# EasyEDA Pro project ProPrj_DMTBlinky2_2025-11-07.epro

# Board DMTBlinky
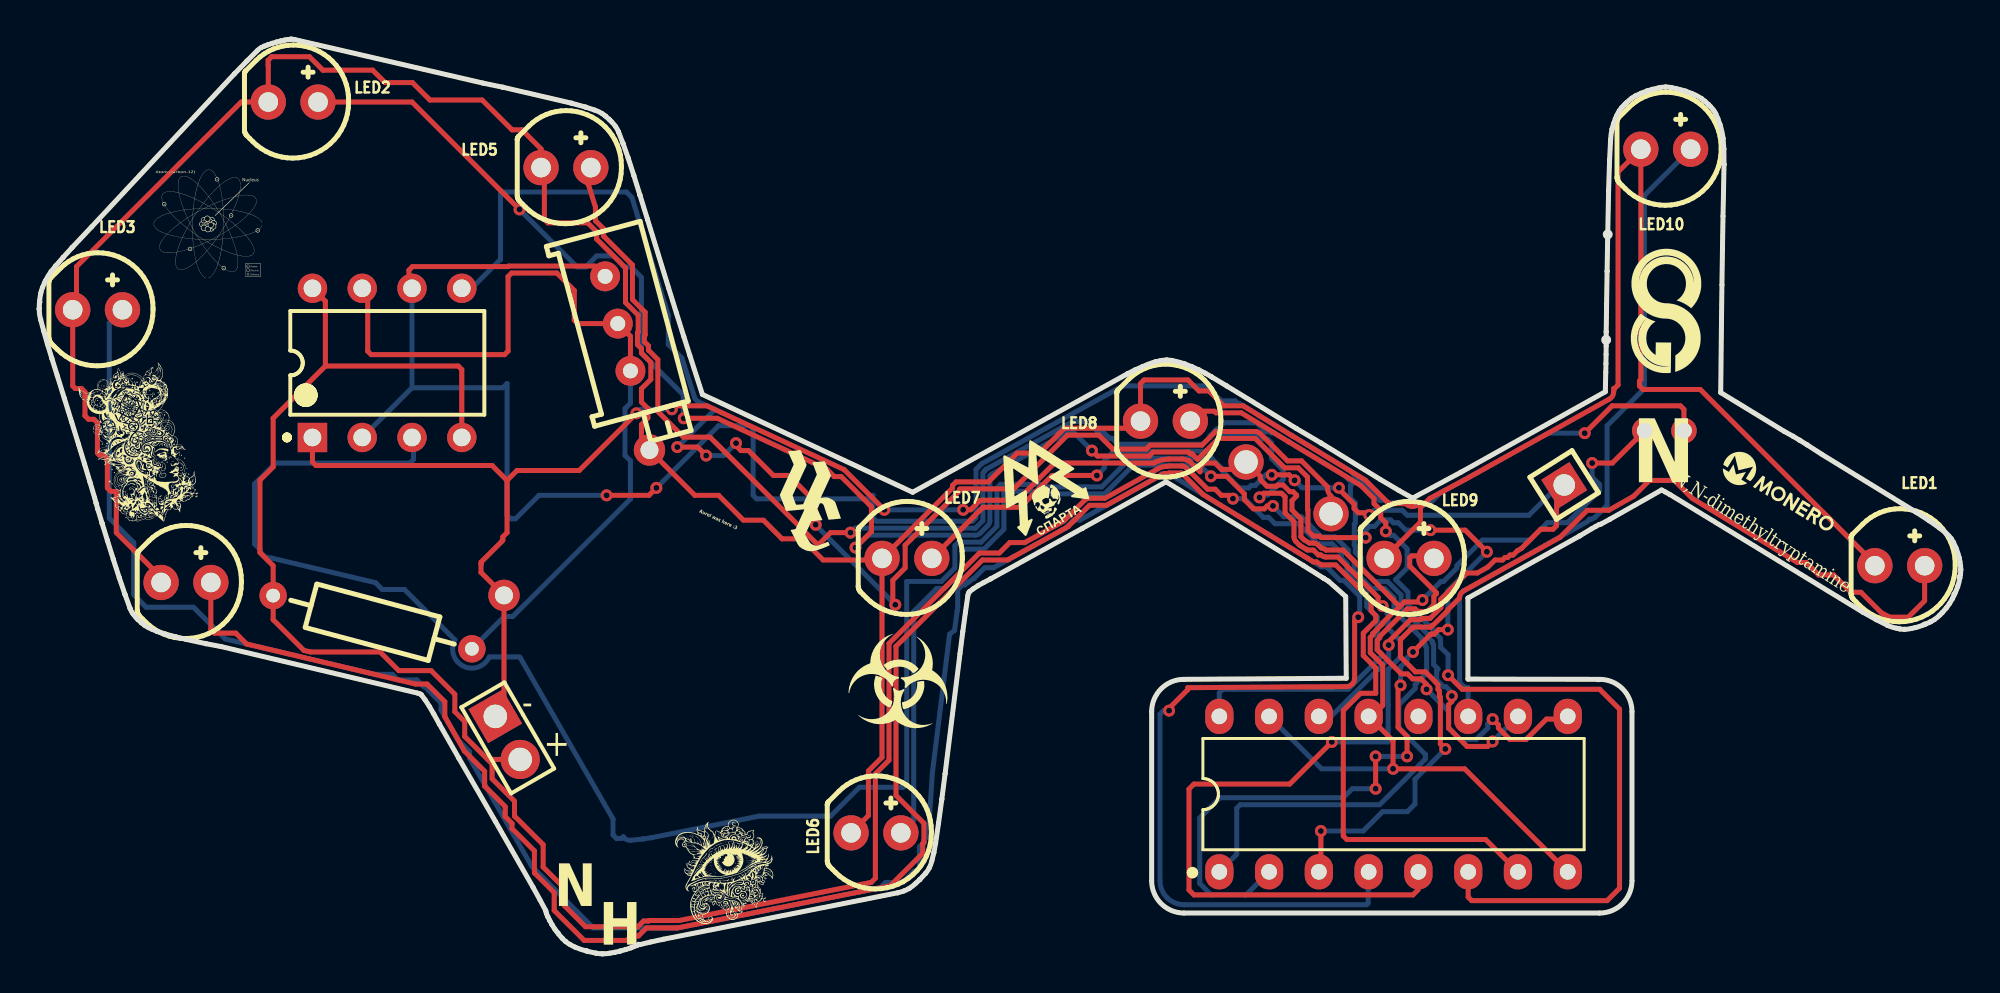
[diagram p0: board, top side]
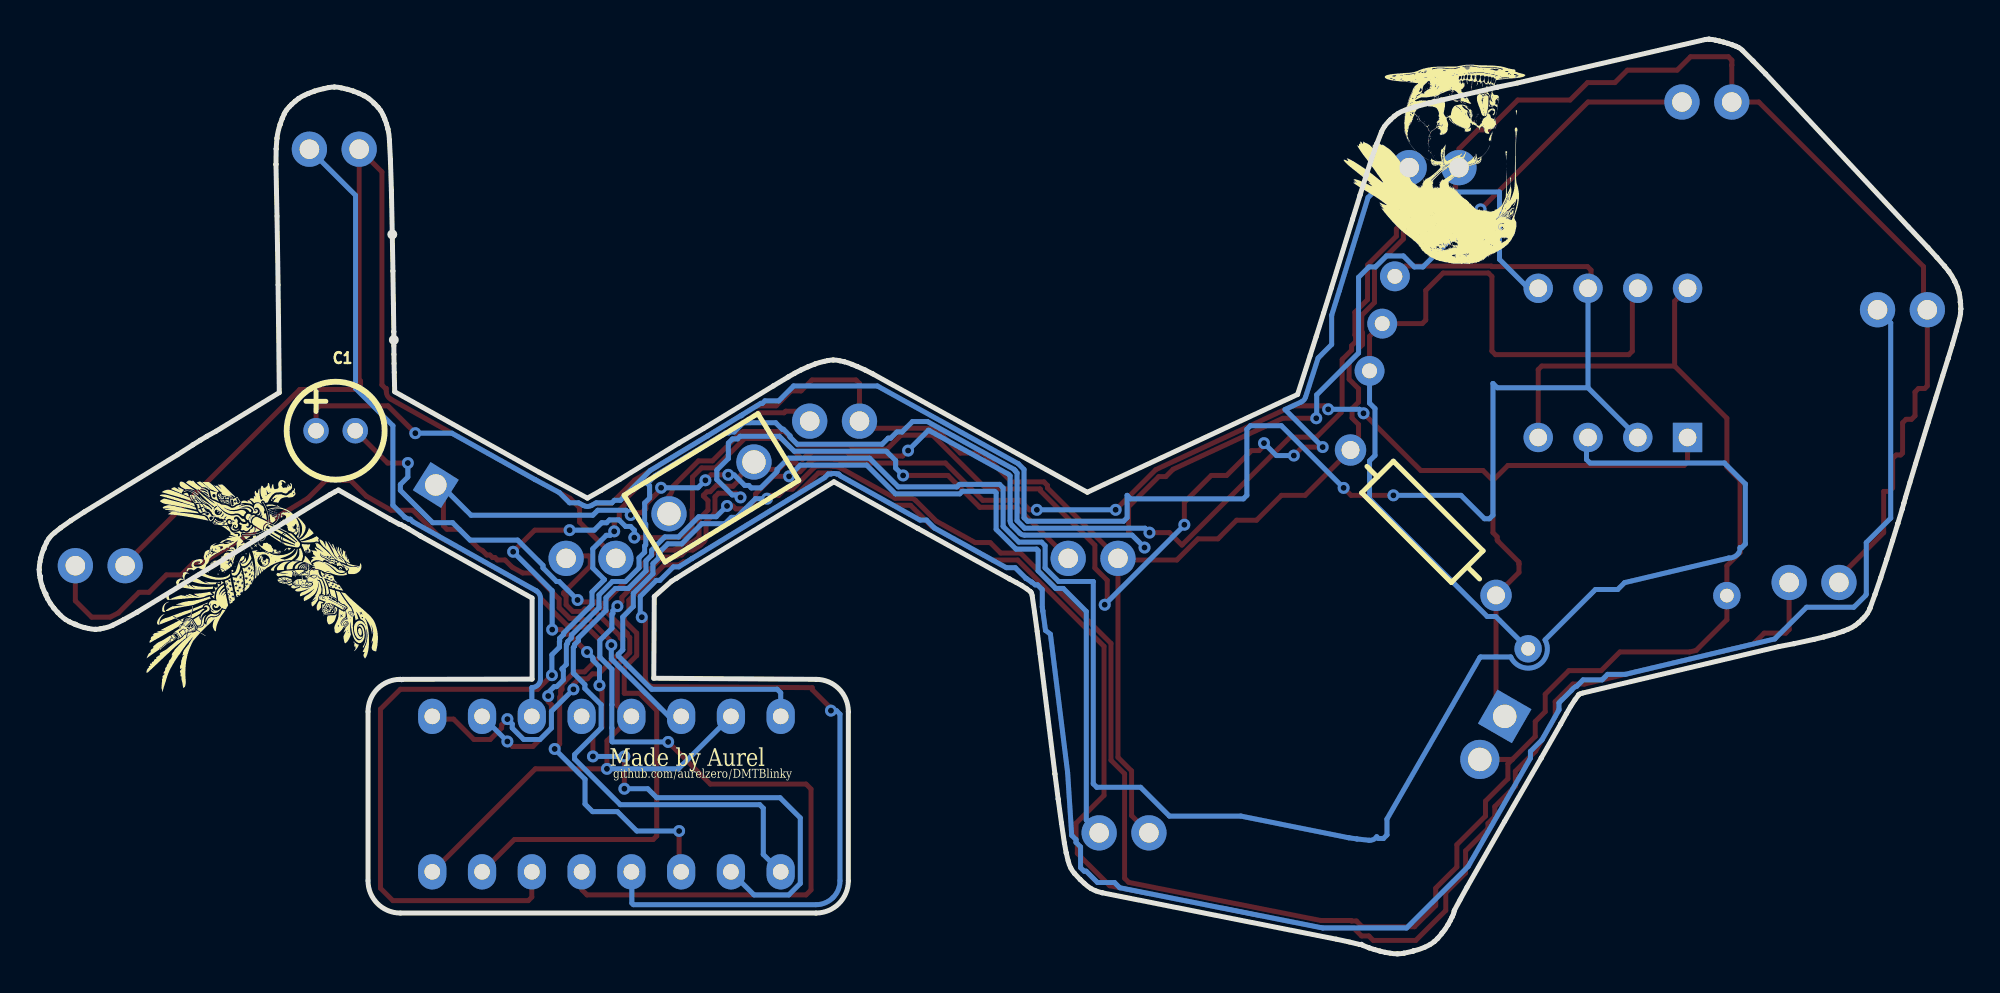
[diagram p1: board, bottom side, seen from below]

Outline 98.06 x 46.72 mm; copper layers: Top Layer, Bottom Layer. Coordinates in mm from the lower left corner of the outline.
Outline path: 0,32.95 arc(0,32.95) 0,32.95 arc(0,32.94) 0,32.94 arc(0,32.83) 0.01,32.72 arc(0.04,32.55) 0.08,32.38 0.22,31.84 arc(0.22,31.84) 0.22,31.83 0.42,31.15 arc(0.42,31.15) 0.42,31.14 0.65,30.42 arc(0.64,30.42) 0.65,30.42 0.92,29.54 1.28,28.38 1.66,27.15 2,26.04 2.31,25.02 2.59,24.09 2.82,23.31 2.9,23.02 arc(2.9,23.02) 2.9,23.02 2.99,22.73 arc(2.99,22.73) 2.99,22.73 3.21,21.99 3.48,21.11 arc(3.48,21.11) 3.48,21.11 3.78,20.15 4.09,19.21 arc(4.09,19.21) 4.09,19.21 4.38,18.36 arc(4.38,18.36) 4.38,18.36 4.63,17.65 arc(4.69,17.52) 4.76,17.4 arc(4.84,17.29) 4.94,17.18 5.03,17.08 arc(5.04,17.08) 5.04,17.08 5.21,16.92 arc(5.21,16.91) 5.21,16.91 arc(5.3,16.84) 5.39,16.78 arc(5.57,16.66) 5.77,16.57 6,16.48 arc(6,16.48) 6.01,16.48 6.45,16.33 arc(6.45,16.33) 6.45,16.33 6.99,16.18 arc(7,16.18) 7,16.18 7.5,16.06 arc(7.5,16.06) 7.5,16.06 8.5,15.84 arc(8.51,15.84) 8.51,15.84 9.28,15.7 19.29,13.32 arc(19.37,13.3) 19.44,13.27 arc(19.48,13.25) 19.51,13.22 arc(19.51,13.22) 19.51,13.22 19.69,12.98 19.9,12.65 20.13,12.26 20.42,11.74 arc(20.42,11.73) 20.42,11.73 21.41,10 23.28,6.77 25.2,3.4 25.55,2.76 25.85,2.21 arc(25.85,2.2) 25.86,2.18 arc(25.86,2.11) 25.89,2.05 25.95,1.9 arc(25.96,1.89) 25.96,1.89 26.05,1.7 arc(26.05,1.7) 26.06,1.69 26.17,1.49 arc(26.17,1.49) 26.17,1.48 arc(26.24,1.37) 26.32,1.25 arc(26.37,1.18) 26.43,1.1 arc(26.45,1.08) 26.47,1.07 arc(26.48,1.04) 26.5,1.01 26.69,0.8 arc(26.69,0.8) 26.69,0.79 arc(26.78,0.71) 26.87,0.63 arc(26.97,0.55) 27.09,0.48 arc(27.22,0.4) 27.35,0.34 arc(27.62,0.23) 27.91,0.15 arc(27.92,0.15) 27.94,0.15 arc(27.94,0.15) 27.95,0.15 arc(27.97,0.13) 28,0.12 28.41,0.04 arc(28.41,0.04) 28.41,0.04 arc(28.56,0.01) 28.71,0 arc(28.74,0) 28.78,0 arc(28.95,0.01) 29.12,0.04 29.36,0.08 arc(29.37,0.08) 29.37,0.08 29.63,0.14 arc(29.63,0.14) 29.64,0.14 29.92,0.22 arc(29.92,0.22) 29.93,0.22 30.19,0.31 arc(30.2,0.31) 30.2,0.31 30.52,0.44 arc(30.56,0.46) 30.58,0.49 arc(30.61,0.48) 30.64,0.47 arc(30.65,0.47) 30.67,0.48 31.2,0.6 31.87,0.75 43.81,3.12 arc(43.81,3.12) 43.82,3.12 arc(43.97,3.16) 44.13,3.21 arc(44.26,3.27) 44.39,3.34 arc(44.57,3.46) 44.74,3.61 44.93,3.79 arc(44.93,3.79) 44.94,3.8 45.23,4.12 arc(45.24,4.12) 45.24,4.12 arc(45.33,4.24) 45.42,4.38 arc(45.5,4.57) 45.55,4.76 45.65,5.16 arc(45.65,5.16) 45.65,5.17 45.74,5.65 arc(45.74,5.66) 45.74,5.66 45.89,6.68 46.06,7.9 arc(46.06,7.9) 46.06,7.9 46.23,9.19 46.99,15.34 47.13,16.47 47.27,17.46 47.39,18.3 arc(47.4,18.37) 47.42,18.43 arc(47.44,18.47) 47.47,18.5 arc(47.48,18.5) 47.48,18.5 47.66,18.64 47.91,18.8 48.19,18.96 48.55,19.15 arc(48.55,19.15) 48.55,19.15 53.23,21.74 arc(53.23,21.74) 53.23,21.74 57.5,24.11 64.52,19.83 65.55,19.18 65.79,19.03 66.67,18.25 66.7,14.08 58.42,14.02 arc(57.25,13.54) 56.77,12.37 56.77,3.73 arc(57.25,2.57) 58.42,2.08 79.63,2.08 arc(80.79,2.57) 81.28,3.73 81.28,12.37 arc(80.79,13.54) 79.63,14.02 arc(79.59,14.02) 79.56,14 arc(79.53,14.02) 79.5,14.02 72.91,14.03 72.91,18.17 78.6,21.34 arc(78.6,21.34) 78.61,21.34 79.21,21.7 79.42,21.83 79.6,21.93 arc(79.65,21.93) 79.7,21.95 80.15,22.2 82.79,23.69 82.97,23.6 83.22,23.46 93.06,17.45 arc(93.07,17.45) 93.07,17.45 93.74,17.07 arc(93.75,17.07) 93.75,17.07 94.3,16.79 arc(94.3,16.79) 94.3,16.79 arc(94.53,16.69) 94.77,16.63 94.94,16.6 arc(94.94,16.6) 94.94,16.6 arc(95.06,16.58) 95.19,16.58 arc(95.19,16.58) 95.19,16.58 arc(95.37,16.59) 95.54,16.62 95.75,16.67 arc(95.75,16.67) 95.75,16.67 arc(95.96,16.73) 96.16,16.8 arc(96.18,16.82) 96.2,16.84 arc(96.21,16.83) 96.22,16.83 arc(96.24,16.84) 96.27,16.85 96.51,16.96 arc(96.51,16.96) 96.51,16.96 arc(96.61,17.01) 96.71,17.07 arc(96.85,17.18) 96.98,17.3 97.1,17.42 arc(97.11,17.43) 97.11,17.43 97.31,17.66 arc(97.31,17.66) 97.31,17.66 arc(97.4,17.77) 97.48,17.89 arc(97.56,18.02) 97.63,18.15 arc(97.67,18.23) 97.71,18.32 arc(97.72,18.34) 97.72,18.36 arc(97.72,18.38) 97.72,18.39 arc(97.75,18.42) 97.78,18.45 97.9,18.76 arc(97.9,18.76) 97.9,18.76 arc(97.96,18.98) 98.01,19.2 arc(98.01,19.21) 98.01,19.22 arc(98,19.25) 97.99,19.28 arc(98.02,19.31) 98.04,19.36 arc(98.05,19.49) 98.06,19.63 arc(98.05,19.83) 98.01,20.03 97.98,20.22 arc(97.98,20.22) 97.98,20.22 arc(97.92,20.44) 97.84,20.66 arc(97.83,20.68) 97.81,20.7 arc(97.81,20.7) 97.81,20.71 arc(97.81,20.73) 97.8,20.76 97.69,21.01 arc(97.69,21.01) 97.69,21.01 arc(97.63,21.11) 97.57,21.21 arc(97.43,21.37) 97.28,21.51 96.97,21.75 arc(96.97,21.76) 96.96,21.76 96.45,22.12 arc(96.45,22.12) 96.45,22.12 95.76,22.57 arc(95.75,22.57) 95.75,22.57 91,25.49 90.21,26 arc(90.21,26) 90.21,26 89.84,26.23 arc(89.84,26.23) 89.84,26.23 89.51,26.43 arc(89.51,26.43) 89.5,26.43 89.04,26.69 85.81,28.67 85.85,32.49 85.87,34.17 85.89,35.99 85.92,37.68 85.95,38.92 85.97,40.32 arc(85.97,40.32) 85.97,40.32 arc(85.97,40.32) 85.97,40.33 85.97,41.11 arc(85.97,41.11) 85.97,41.12 85.93,41.65 arc(85.92,41.65) 85.92,41.65 arc(85.86,42) 85.77,42.34 arc(85.77,42.35) 85.76,42.36 arc(85.76,42.38) 85.76,42.39 85.66,42.66 arc(85.66,42.67) 85.65,42.67 85.55,42.91 arc(85.55,42.91) 85.55,42.91 arc(85.5,43) 85.45,43.08 arc(85.36,43.19) 85.27,43.29 85.18,43.39 arc(85.17,43.39) 85.17,43.39 85,43.55 arc(85,43.55) 84.99,43.55 84.83,43.68 arc(84.83,43.68) 84.82,43.68 arc(84.67,43.78) 84.51,43.86 84.33,43.95 arc(84.32,43.95) 84.32,43.95 84.01,44.06 arc(84.01,44.07) 84.01,44.07 arc(83.78,44.14) 83.54,44.19 83.28,44.25 arc(83.28,44.25) 83.28,44.25 arc(83.14,44.27) 83,44.28 arc(82.99,44.28) 82.99,44.28 arc(82.82,44.27) 82.64,44.23 82.32,44.16 arc(82.32,44.16) 82.31,44.16 82.04,44.07 arc(82.04,44.07) 82.03,44.07 81.74,43.96 arc(81.74,43.96) 81.74,43.95 81.47,43.83 arc(81.47,43.83) 81.47,43.83 arc(81.37,43.77) 81.27,43.71 arc(81.13,43.6) 81,43.48 arc(80.98,43.46) 80.97,43.44 arc(80.94,43.42) 80.92,43.41 80.77,43.24 arc(80.76,43.24) 80.76,43.24 arc(80.7,43.16) 80.64,43.08 arc(80.56,42.95) 80.5,42.82 80.43,42.66 arc(80.43,42.65) 80.43,42.65 80.33,42.39 arc(80.33,42.39) 80.33,42.38 80.26,42.14 arc(80.26,42.13) 80.26,42.13 arc(80.21,41.86) 80.19,41.59 80.13,40.55 arc(80.13,40.55) 80.13,40.55 80.09,39.01 arc(80.09,39.01) 80.09,39.01 80.04,36.75 80.01,34.87 79.98,33.19 79.96,31.78 arc(79.96,31.78) 79.96,31.78 79.96,31.36 79.96,31.05 79.96,30.62 79.95,30.15 79.94,29.7 79.92,28.71 72.55,24.6 70.08,23.28 69.39,23.66 68.43,24.23 65.41,26.09 arc(65.41,26.09) 65.41,26.09 64.16,26.83 60.6,29.01 arc(60.6,29.01) 60.6,29.01 59.83,29.47 arc(59.83,29.47) 59.83,29.47 59.51,29.65 arc(59.51,29.66) 59.5,29.66 59.19,29.82 arc(59.19,29.82) 59.18,29.82 58.82,29.99 arc(58.82,29.99) 58.82,29.99 58.47,30.13 arc(58.46,30.13) 58.46,30.13 arc(58.23,30.21) 57.99,30.26 57.82,30.3 arc(57.81,30.3) 57.81,30.3 arc(57.68,30.32) 57.55,30.33 arc(57.54,30.33) 57.53,30.33 arc(57.36,30.32) 57.2,30.29 56.97,30.24 arc(56.97,30.24) 56.96,30.24 arc(56.77,30.18) 56.59,30.11 56.31,30 arc(56.31,30) 56.31,30 55.91,29.82 arc(55.91,29.82) 55.9,29.82 55.53,29.63 arc(55.53,29.63) 55.53,29.63 44.57,23.58 33.84,28.57 33.2,30.56 32.9,31.52 32.51,32.74 32.12,34.01 31.04,37.52 30.65,38.76 30.35,39.75 arc(30.35,39.75) 30.35,39.75 30.06,40.64 arc(30.06,40.64) 30.06,40.64 29.79,41.39 arc(29.79,41.39) 29.79,41.39 29.56,41.98 arc(29.49,42.13) 29.41,42.27 arc(29.3,42.4) 29.18,42.53 29.09,42.62 arc(29.09,42.62) 29.09,42.62 28.9,42.79 arc(28.9,42.79) 28.9,42.79 arc(28.81,42.86) 28.72,42.92 arc(28.53,43.03) 28.34,43.1 27.89,43.25 arc(27.88,43.25) 27.88,43.25 27.16,43.45 arc(27.16,43.45) 27.15,43.45 23.65,44.27 arc(23.65,44.27) 23.64,44.27 22.63,44.48 13.03,46.7 arc(12.95,46.72) 12.87,46.72 arc(12.85,46.72) 12.84,46.72 12.84,46.72 arc(12.76,46.71) 12.68,46.7 12.53,46.67 arc(12.52,46.67) 12.52,46.67 12.31,46.62 arc(12.31,46.62) 12.31,46.62 12.1,46.57 arc(12.1,46.57) 12.1,46.57 11.89,46.51 arc(11.89,46.51) 11.89,46.51 11.67,46.43 arc(11.67,46.43) 11.67,46.43 11.48,46.36 arc(11.48,46.36) 11.47,46.36 arc(11.4,46.33) 11.34,46.29 arc(11.24,46.23) 11.15,46.16 10.6,45.61 arc(10.6,45.61) 10.6,45.61 9.96,44.95 arc(9.96,44.95) 9.96,44.94 2.67,37.13 1.68,36.07 arc(1.68,36.07) 1.68,36.07 1.22,35.57 arc(1.22,35.57) 1.22,35.57 0.83,35.13 arc(0.83,35.13) 0.83,35.12 0.61,34.86 arc(0.61,34.85) 0.61,34.85 arc(0.46,34.63) 0.33,34.38 arc(0.32,34.37) 0.32,34.35 arc(0.3,34.34) 0.29,34.32 arc(0.23,34.18) 0.17,34.03 arc(0.12,33.9) 0.09,33.76 arc(0.05,33.55) 0.02,33.34 arc(0.02,33.34) 0.02,33.33 arc(0.02,33.31) 0.03,33.29 arc(0.02,33.26) 0.01,33.22 0,32.95
Stack: Top Layer 0.035mm / Dielectric1 1.51mm FR4 er 4.5 / Bottom Layer 0.035mm

## Design rules (mm)
template: JLCPCB Capability(Two Layers Board)
spacing copperThickness1oz (default): track to track 0.102, other pairs 0.152 to 0.3
spacing copperThickness2oz: track to track 0.203, other pairs 0.152 to 0.3
track width copperThickness1oz (default): min 0.127, default 0.254, max 2.54
track width copperThickness2oz: min 0.203, default 0.254, max 2.54
differential pair differentialPair (default): width min 0.127, default 0.254, max 2.54; gap min 0.152, default 0.152
via viaSize (default): diameter min 0.5, default 0.61, max 10; hole min 0.3, default 0.305, max 6.3

## Placement (name value [footprint] x y rotation side)
C1  1uF  [CAP-TH_BD5.0-P2.00-D0.8-FD]  82.93 26.72 180 bottom
C2  10nF  [CAP-TH_L8.0-W4.0-P5.00-D1.2]  63.75 23.8 328.6 bottom
H1  PZ254V-11-02P  [HDR-TH_2P-P2.54-V-M]  23.91 11.03 300 top
LED1  XL-502UWC  [LED-TH_BD5.9-P2.54-RD_WHITE]  94.94 19.83 0 top
LED2  XL-502UWC  [LED-TH_BD5.9-P2.54-RD_WHITE]  12.96 43.51 0 top
LED3  XL-502UWC  [LED-TH_BD5.9-P2.54-RD_WHITE]  2.98 32.9 0 top
LED4  XL-502UWC  [LED-TH_BD5.9-P2.54-RD_WHITE]  7.49 18.97 0 top
LED5  XL-502UWC  [LED-TH_BD5.9-P2.54-RD_WHITE]  26.88 40.16 0 top
LED6  XL-502UWC  [LED-TH_BD5.9-P2.54-RD_WHITE]  42.7 6.18 0 top
LED7  XL-502UWC  [LED-TH_BD5.9-P2.54-RD_WHITE]  44.28 20.2 0 top
LED8  XL-502UWC  [LED-TH_BD5.9-P2.54-RD_WHITE]  57.47 27.21 0 top
LED9  XL-502UWC  [LED-TH_BD5.9-P2.54-RD_WHITE]  69.9 20.2 0 top
LED10  XL-502UWC  [LED-TH_BD5.9-P2.54-RD_WHITE]  83 41.1 0 top
P1  Header Male  [HDR-TH_1P-P2.54-V-M]  77.82 23.95 32.2 top
R1  1kΩ  [RES-TH_BD2.3-L6.5-P10.50-D0.5]  17.01 16.94 165 top
R2  470Ω  [RES-TH_BD2.2-L6.5-P10.50-D0.6]  27.43 22.02 45 bottom
R3  50kΩ  [RES-ADJ-TH_3P-L9.5-W4.85-P2.50-BL-L]  29.52 32.19 15 top
U1  100kHz  [DIP-8_L9.8-W6.6-P2.54-LS7.6-BL]  17.75 30.19 0 top
U2  CD4017BE(LX)  [PDIP-16_L19.3-W6.4-P2.54-LS7.94-BL]  69.11 8.16 0 top

## Footprints (pads in the part's own frame, mm; a bottom-side part is the same pattern mirrored in y, then rotated)
CAP-TH_BD5.0-P2.00-D0.8-FD
  round 1.3 hole 0.8: 1(-1,0) 2(1,0)
CAP-TH_L8.0-W4.0-P5.00-D1.2
  round 1.8 hole 1.2: 1(-2.54,0) 2(2.54,0)
DIP-8_L9.8-W6.6-P2.54-LS7.6-BL
  rect 1.5x1.5 hole 0.9: 1(-3.81,-3.81)
  round 1.5 hole 0.9: 2(-1.27,-3.81) 3(1.27,-3.81) 4(3.81,-3.81) 5(3.81,3.81) 6(1.27,3.81) 7(-1.27,3.81) 8(-3.81,3.81)
HDR-TH_1P-P2.54-V-M
  rect 1.7x1.7 hole 1.1: 1(0,0)
HDR-TH_2P-P2.54-V-M
  rect 2x2 hole 1.2: 1(-1.27,0)
  round 2 hole 1.2: 2(1.27,0)
LED-TH_BD5.9-P2.54-RD_WHITE
  round 1.8 hole 1: 1(-1.27,0) 2(1.27,0)
PDIP-16_L19.3-W6.4-P2.54-LS7.94-BL
  oval 1.44x1.8 hole 0.8: 1(-8.89,-3.97) 2(-6.35,-3.97) 3(-3.81,-3.97) 4(-1.27,-3.97) 5(1.27,-3.97) 6(3.81,-3.97) 7(6.35,-3.97) 8(8.89,-3.97) 9(8.89,3.97) 10(6.35,3.97) 11(3.81,3.97) 12(1.27,3.97) 13(-1.27,3.97) 14(-3.81,3.97) 15(-6.35,3.97) 16(-8.89,3.97)
RES-ADJ-TH_3P-L9.5-W4.85-P2.50-BL-L
  round 1.524 hole 0.762: 1(0,2.5) 2(0,0) 3(0,-2.5)
RES-TH_BD2.2-L6.5-P10.50-D0.6
  round 1.6 hole 0.914: 1(-5.25,0) 2(5.25,0)
RES-TH_BD2.3-L6.5-P10.50-D0.5
  round 1.4 hole 0.7: 1(-5.25,0) 2(5.25,0)

## Nets
R2_2: LED1.1 LED2.1 LED3.1 LED4.1 LED5.1 LED6.1 LED7.1 LED8.1 LED9.1 LED10.1 R2.2
U1_1: C1.2 C2.1 H1.1 R2.1 U1.1 U2.8 U2.13 U2.15
U1_2: C1.1 R3.1 U1.2 U1.6
U1_3: P1.1 U1.3 U2.14
U1_4: H1.2 R1.2 U1.4 U1.8 U2.16
U1_5: C2.2 U1.5
U1_7: R1.1 R3.2 R3.3 U1.7
U2_1: LED6.2 U2.1
U2_2: LED2.2 U2.2
U2_3: LED1.2 U2.3
U2_4: LED3.2 U2.4
U2_5: LED7.2 U2.5
U2_6: LED8.2 U2.6
U2_7: LED4.2 U2.7
U2_9: LED9.2 U2.9
U2_10: LED5.2 U2.10
U2_11: LED10.2 U2.11

Pads without a net: U2 12

## Via types
v1: diameter 0.61, hole 0.305, Top Layer to Bottom Layer, 51 vias

## Routing (per net, layer and track width the routed paths; a pad name or vN(x,y) marks a point on that pad's centre or on a via; arc(x,y) is an arc through that point)
R2_2: length 189.3
  Top Layer w0.254: 70.69,23 70.48,22.78 70.48,22.05 LED9.1 ; 70.69,23 70.46,23 70.28,22.9 arc(70.08,22.85) 69.87,22.9 69.71,23 68.87,23 67.67,24.2 63.95,26.46 arc(63.94,26.46) 63.94,26.46 61.44,27.99 60.45,27.99 59.69,28.75 59.18,28.75 58.62,29.31 56.38,29.31 56.2,29.13 LED8.1 55.84,26.85 52.32,26.85 51.05,25.58 49.91,25.58 48.44,24.11 46.79,24.11 46.61,23.93 46.61,23.8 LED7.1 ; 70.69,23 70.96,23.27 72.76,24.23 arc(72.76,24.23) 72.76,24.23 80.12,28.34 arc(80.28,28.49) 80.34,28.7 80.35,28.88 80.39,28.88 80.57,29.06 80.57,39.94 LED10.1 81.73,29.33 81.66,29.26 81.66,29.01 81.84,28.83 84.76,28.83 93.67,19.91 LED1.1 ; LED7.1 43.01,10.04 42.31,9.34 42.31,7.06 LED6.1 ; LED7.1 42.93,20.12 40,20.12 38.92,21.2 37.91,21.2 36.95,22.15 35.94,22.15 34.67,23.42 33.46,23.42 30.73,26.15 30.73,27.04 31.06,27.37 31.06,27.85 30.73,28.18 30.73,28.86 31.21,29.35 31.21,30.21 30.73,30.69 30.73,30.91 30.53,31.12 30.53,31.72 30.57,31.76 30.57,32.62 29.92,33.27 29.92,35.04 28.45,36.51 28.45,36.88 27.99,37.34 25.96,37.34 25.78,37.52 25.78,39.99 LED5.1 25.61,41.12 24.64,42.09 24.13,42.09 22.6,43.61 19.94,43.61 19.05,44.5 17.65,44.5 17.02,45.14 14.48,45.14 13.79,45.82 11.86,45.82 11.68,45.64 11.68,45.39 11.69,45.38 LED2.1 10.31,43.51 1.9,35.1 1.9,33.09 LED3.1 1.71,29.01 1.84,28.88 2.16,28.88 2.34,28.7 2.34,27.48 2.52,27.3 2.79,27.3 2.97,27.12 2.97,25.58 3.07,25.48 3.3,25.48 3.48,25.3 3.48,23.8 3.66,23.62 3.94,23.62 3.94,21.51 6.22,19.23 LED4.1
U1_1: length 126.2
  Top Layer w0.254: 69.42,17.74 69.66,17.97 70.48,17.97 v1(70.58,18.07) ; 69.42,17.74 66.54,20.63 65.66,20.63 arc(65.55,20.7) 65.42,20.73 65.27,20.88 arc(65.16,20.95) 65.02,20.98 64.82,20.98 64.54,21.15 64.39,21.3 64.39,22.21 63.93,22.67 63.93,23.15 64.16,23.39 64.16,23.43 63.98,23.6 63.82,23.6 63.48,23.95 63.2,23.95 63.14,23.88 62.65,23.88 62.31,24.23 62.31,24.4 C2.1 61.21,24.75 60.32,24.75 60,25.07 59.43,25.07 59.24,24.88 59.24,24.62 58.67,25.19 58.62,25.19 arc(58.46,25.25) 58.29,25.27 57.66,25.27 arc(57.56,25.27) 57.47,25.25 arc(57.3,25.23) 57.14,25.19 arc(57.04,25.15) 56.95,25.11 56.88,25.07 51.81,25.07 49.91,23.17 48.01,23.17 47.53,22.68 v1(47.15,22.68) ; 69.42,17.74 69.13,17.44 69.09,17.44 68.56,16.91 68.56,16.87 68.05,16.36 68.05,16.29 67.92,16.16 67.92,15.38 68.56,14.75 68.56,12.68 67.92,12.05 ; 67.92,12.05 U2.13 ; 67.92,12.05 69.09,10.88 v1(69.09,9.45) 72.74,9.45 U2.8 ; U1.1 13.94,25.12 14.12,24.94 23.11,24.94 23.87,24.18 ; v1(79.25,25.07) 80.28,25.07 C1.2 ; v1(30.48,27.61) 27.56,24.69 24.38,24.69 23.87,24.18 ; 23.87,24.18 23.87,21.51 23.66,21.3 23.66,21.14 23.62,21.11 23.62,21.08 22.55,20.01 22.55,19.91 22.55,19.9 22.55,19.48 R2.1 23.72,12.57 23.27,12.13 ; v1(43.13,22.68) 41.07,24.73 34.08,27.99 32.46,27.99 v1(32.28,27.82)
  Bottom Layer w0.254: v1(79.25,25.07) 79.25,24.35 79.63,23.97 79.63,23.67 77.98,22.02 76.96,22.02 76.07,21.13 73.64,21.13 72.35,19.84 72.35,19.71 71.66,19.02 71.53,19.02 v1(70.58,18.07) ; v1(30.48,27.61) 30.68,27.82 v1(32.28,27.82) ; v1(43.13,22.68) v1(47.15,22.68) ; U2.15 65.44,9.45 v1(69.09,9.45)
U1_2: length 107.4
  Top Layer w0.254: v1(28.95,23.42) 31.11,23.42 v1(31.49,23.8) ; U1.6 18.87,34.15 18.87,34.92 19.05,35.1 23.93,35.1 23.96,35.13 28.35,35.13 R3.1 ; C1.1 83.93,27.81 83.75,27.99 80.26,27.99 v1(78.86,26.59)
  Bottom Layer w0.254: v1(78.86,26.59) 77,26.59 72.76,24.23 arc(72.76,24.23) 72.76,24.23 71.51,23.56 70.99,23.04 70.54,23.04 70.28,22.9 arc(70.08,22.85) 69.87,22.9 69.63,23.04 68.83,23.04 68.7,23.17 68.4,23.17 66.87,24.69 63.95,26.46 arc(63.94,26.46) 63.94,26.46 62.27,27.48 62.23,27.48 62.16,27.55 61.23,28.12 61.15,28.12 61.02,28.25 60.32,28.25 59.56,29.01 55.29,29.01 48.1,25.03 47.8,24.74 47.8,22.28 47.62,22.1 42.72,22.1 42.54,22.28 42.54,23.42 42.36,23.24 36.61,23.24 36.43,23.42 36.43,26.8 36.25,26.98 34.67,26.98 v1(31.49,23.8) ; v1(28.95,23.42) 25.5,23.42 24.31,22.22 24.05,22.22 23.87,22.4 23.87,29.13 23.66,28.92 19.02,28.92 ; 19.25,33.77 U1.6 19.02,28.92 ; 19.02,28.92 U1.2
U1_3: length 126.2
  Top Layer w0.254: v1(68.86,15.77) 68.86,15.96 69.98,17.07 70.48,17.07 70.54,17.13 70.97,17.13 71.52,17.69 71.52,18.12 72.86,19.45 73.38,19.45 73.92,19.75 74.29,20.12 74.67,20.12 74.8,20.24 74.93,20.24 75.05,20.37 75.21,20.37 75.44,20.6 75.64,20.71 76.62,21.69 77.25,21.69 77.43,21.87 77.43,23.7 77.68,23.95 P1.1 ; v1(62.89,24.47) 63.78,24.47 v1(64.06,24.19) ; v1(67.87,22.41) 67.76,22.53 67.31,22.53 67.1,22.74 67.1,22.97 66.32,23.74 v1(66.32,23.81)
  Bottom Layer w0.254: v1(67.87,22.41) 68.12,22.66 69.55,22.66 69.81,22.4 76.02,22.4 77.56,23.95 P1.1 ; v1(62.89,24.47) 62.59,24.47 62.05,23.93 61.85,23.93 61.72,23.8 61.24,23.8 60.4,24.64 60.4,24.73 59.82,25.32 55.68,25.32 54.21,23.85 51.23,23.85 51.1,23.98 49.05,23.98 48.87,23.8 48.87,21.83 48.07,21.03 46.91,21.03 46.73,20.85 46.73,19.71 46.04,19.02 44.27,19.02 44.27,8.69 44.09,8.51 41.86,8.51 40.38,7.04 36.73,7.04 31.25,5.93 arc(31.24,5.93) 31.23,5.93 30.82,5.87 arc(30.81,5.87) 30.8,5.87 30.2,5.8 arc(29.98,5.84) 29.8,5.98 29.72,5.89 29.46,5.89 29.28,6.07 29.28,6.88 24.55,15.13 24.51,15.16 22.97,15.16 arc(21.66,14.69) 21.19,16 arc(21.2,16.02) 21.21,16.04 18.64,18.61 17.51,18.61 17.16,18.96 11.84,20.22 arc(11.57,20.28) 11.35,20.45 arc(11.29,20.57) 11.26,20.71 11.26,20.75 11.17,20.75 10.99,20.93 10.99,24 12.06,25.07 18.92,25.07 19.1,25.25 19.1,26.3 U1.3 ; v1(64.06,24.19) 64.44,23.81 v1(66.32,23.81) ; v1(68.86,15.77) 68.86,15.07 65.92,12.13 U2.14
U1_4: length 128.6
  Top Layer w0.254: 22.89,9.93 21.71,11.1 21.71,11.86 21.21,12.37 21.21,13.26 20,14.47 18.35,14.47 17.4,15.42 13.84,15.42 13.51,15.5 11.94,17.07 11.94,19.82 11.26,20.5 11.26,24.19 11.94,24.87 11.94,27.36 14.6,30.02 ; 22.89,9.93 23.11,9.7 23.11,8.94 24.25,7.8 24.25,7.04 25.72,5.58 25.72,4.43 26.8,3.35 26.8,2.46 27.87,1.38 30.55,1.38 30.84,1.68 31.09,1.68 31.11,1.7 32.65,1.7 42.46,3.65 42.67,3.86 42.67,9.2 43.36,9.89 43.36,15.85 47.98,20.47 48.99,20.47 49.53,21.01 50.29,21.01 52.28,22.11 53.34,23.16 arc(53.46,23.24) 53.59,23.27 54.38,23.27 57.12,24.8 arc(57.32,24.87) 57.53,24.89 arc(57.59,24.91) 57.66,24.92 58.29,24.92 arc(58.43,24.89) 58.54,24.81 59.62,23.74 60.01,23.74 60.32,23.42 60.74,23.42 v1(60.92,23.25) ; 22.89,9.93 H1.2 ; 14.6,30.02 14.6,33.34 U1.8 ; 14.6,30.02 21.38,30.02 21.56,29.84 U1.4
  Bottom Layer w0.254: U2.16 60.22,13.33 60.4,13.51 66.8,13.51 68.51,15.22 68.51,15.3 68.28,15.53 68.28,17.2 67.74,17.74 67.74,18.41 66.74,19.42 66.74,19.93 66.45,20.22 66.45,20.47 65.98,20.94 65.27,20.94 64.24,21.97 63.06,21.97 62.74,22.29 62.46,22.29 61.51,23.25 v1(60.92,23.25)
U1_5: length 74.1
  Top Layer w0.254: v1(39.62,21.92) 39.62,23.06 38.25,24.44 37.46,24.44 36.19,25.71 35.81,25.71 35.56,25.96 v1(35.56,26.09) ; v1(32.56,25.88) 33.6,25.88 v1(34.03,25.45) ; 65.79,22.48 65.92,22.48 65.92,23.38 arc(65.78,23.6) 65.74,23.85 64.41,25.18 63.7,25.18 62.3,26.58 arc(62.21,26.64) 62.1,26.68 62.1,26.68 60.03,26.68 59.34,25.99 56.7,25.99 56.49,25.78 54.78,25.78 54.08,26.49 52.47,26.49 49.73,23.75 46.99,23.75 46.96,23.72 46.96,23.65 44.19,20.88 44.19,19.71 43.56,19.08 43.56,17.96 v1(43.69,17.83)
  Bottom Layer w0.254: v1(43.69,17.83) 39.62,21.9 v1(39.62,21.92) ; 31.71,33.88 30.25,38.63 29.97,38.91 23.54,38.91 23.54,35.47 22.06,34 U1.5 ; 31.71,33.88 32.1,32.61 32.1,31.12 32.8,30.43 33.44,28.44 arc(33.52,28.29) 33.66,28.19 34.48,27.8 v1(32.56,25.88) ; v1(34.03,25.45) 34.92,25.45 v1(35.56,26.09)
U1_7: length 42.8
  Top Layer w0.254: U1.7 16.76,33.72 16.76,30.79 16.94,30.61 23.75,30.61 23.93,30.79 23.93,34.6 24.11,34.77 26.41,34.77 27.3,33.89 27.3,32.37 27.48,32.19 R3.2 30.17,31.54 R3.3
  Bottom Layer w0.254: 22.08,15.58 23.73,17.23 24.16,17.23 30.17,23.24 30.17,25.18 29.89,25.46 29.89,27.85 30.17,28.13 R3.3
U2_1: length 68.9
  Top Layer w0.254: v1(59.79,24.39) 60.6,24.39 61.5,23.49 61.5,23.2 61.97,22.73 62.51,22.73 62.66,22.88 v1(62.96,22.88)
  Bottom Layer w0.254: v1(62.96,22.88) 63.51,22.33 64.4,22.33 65.43,21.3 66.13,21.3 66.81,20.62 66.81,20.36 67.09,20.08 67.09,19.56 67.99,18.66 68.66,18.66 69.14,18.19 69.14,17.54 70.55,16.13 70.55,15.99 70.74,15.8 70.74,15.71 70.8,15.65 70.8,14.34 70.21,13.75 70.21,13.56 69.38,12.72 69.38,11.54 70.74,10.18 70.74,9.95 68.4,7.62 61.29,7.62 61.11,7.44 61.11,5.08 U2.1 ; LED6.2 44.63,6.84 44.63,17.49 45.8,18.66 46.18,18.66 47.08,19.56 47.08,20.6 47.16,20.67 48.21,20.67 49.23,21.69 49.23,23.55 49.3,23.62 50.95,23.62 51.08,23.5 54.36,23.5 55.83,24.96 59.22,24.96 v1(59.79,24.39)
U2_2: length 117.4
  Top Layer w0.254: v1(41.65,20.75) 42.47,21.57 42.47,22.84 40.93,24.38 40.57,24.38 40.2,24.75 34.6,27.36 33.14,27.36 33.02,27.23 ; v1(73.87,20.54) 72.77,21.64 v1(70.99,21.64) ; v1(70.1,15.42) 71.02,16.33 71.18,16.33 71.41,16.56 v1(71.88,16.56) ; v1(24.51,38.02) 19.02,43.51 LED2.2 ; v1(67.69,21.26) 65.41,21.26 65.33,21.34 65.02,21.34 64.74,21.62 64.74,22.68 64.72,22.7 64.72,24.35 64.25,24.82 63.55,24.82 62.05,26.32 60.18,26.32 59.11,25.25 58.82,25.55 58.75,25.55 58.71,25.58 58.68,25.58 58.64,25.63 56.84,25.63 56.64,25.43 54,25.43 v1(53.72,25.71) ; v1(69.8,10.08) 69.8,11.11 69.34,11.58 69.34,13.59 v1(69.47,13.71) ; v1(68.2,8.43) v1(68.2,10.08)
  Bottom Layer w0.254: U2.2 61.58,3.01 59.8,3.01 59.22,3.6 59.22,6.94 60.25,7.97 66.54,7.97 67,8.43 v1(68.2,8.43) ; v1(69.47,13.71) 69.47,14.67 69.8,15 69.8,15.12 v1(70.1,15.42) ; v1(24.51,38.02) 27.45,35.09 27.89,35.09 28.45,35.65 29.31,35.65 29.87,35.09 30.2,35.09 30.73,34.56 30.73,30.69 32.87,28.55 32.87,27.38 v1(32.89,27.36) ; v1(68.2,10.08) v1(69.8,10.08) ; v1(41.65,20.75) 42.29,21.38 47.77,21.38 arc(47.91,21.41) 48.02,21.49 48.41,21.88 arc(48.49,21.99) 48.51,22.13 48.51,24.42 48.59,24.5 52.66,26.74 52.68,26.74 v1(53.72,25.71) ; v1(71.88,16.56) 71.88,18.54 v1(73.87,20.54) ; v1(70.99,21.64) 69.73,21.64 69.36,22.02 69.1,22.02 68.96,22.16 68.47,22.16 68.13,21.83 67.88,21.83 67.69,21.64 v1(67.69,21.26)
U2_3: length 52
  Top Layer w0.254: U2.3 65.4,4.29 v1(65.4,6.27) ; LED1.2 96.21,18.03 95.37,17.2 94.44,17.2 94.02,17.41 92.96,18.47 92.45,18.47 91.56,19.36 90.8,19.36 90.17,19.99 89.72,19.99 84.35,23.26 83.44,24.18 82.17,24.18 81.36,23.38 80.09,22.66 78.99,22.66 77.62,21.28 72.7,18.55 arc(72.54,18.39) 72.48,18.17 71.88,17.57 71.88,17.54 71.12,16.78 71.08,16.78 70.99,16.69 70.1,16.69 69.47,16.05 69.47,15.16 70.23,14.4 70.74,14.4 71.24,13.89 71.24,13.89 71.38,13.75 71.38,13.51 71.45,13.44 71.45,13.16 71.5,13.11 71.5,10.72 v1(71.75,10.47)
  Bottom Layer w0.254: v1(71.75,10.47) 70.2,8.92 70.2,7.65 69.82,7.26 68.55,7.26 67.56,6.27 v1(65.4,6.27)
U2_4: length 140.1
  Top Layer w0.254: v1(67.31,17.2) 67.12,17.01 67.12,14.08 arc(67,13.78) 66.7,13.65 58.61,13.6 58.61,13.5 57.66,12.54 v1(57.66,12.42) ; U2.4 67.84,4.7
  Bottom Layer w0.254: LED3.2 3.58,32.23 3.58,22.25 4.82,21.01 4.82,18.38 4.85,18.32 5.46,17.7 7.87,17.7 9.49,16.08 17.12,14.28 18.02,14.28 18.31,13.99 19.27,13.99 19.59,13.67 arc(19.74,13.59) 19.86,13.47 20.5,12.82 20.5,12.47 21.37,10.93 21.96,10.34 21.96,9.99 25.14,4.46 28.28,1.32 32.56,1.32 42.92,3.38 43.18,3.64 44.05,3.64 44.63,4.22 44.74,4.22 44.92,4.4 44.92,5.46 45.15,5.69 45.15,5.83 45.37,6.05 45.58,9.26 46.46,16.33 46.71,16.52 arc(46.71,16.53) 46.71,16.53 46.84,17.52 arc(46.84,17.52) 46.84,17.52 46.87,17.71 46.87,18.6 47.11,18.85 47.23,18.85 47.4,18.98 arc(47.41,18.99) 47.42,19 47.67,19.16 arc(47.69,19.17) 47.7,19.18 47.71,19.18 48.25,19.72 48.7,19.72 52.37,21.75 52.78,22.16 53.11,22.16 57.17,24.41 57.26,24.51 57.35,24.51 arc(57.5,24.54) 57.66,24.51 57.79,24.51 57.98,24.32 64.74,20.19 arc(64.74,20.19) 64.74,20.19 65.42,19.77 65.69,19.77 66.38,19.08 66.57,19.08 67.39,18.26 67.39,17.27 v1(67.31,17.2) ; U2.4 67.82,4.17 67.82,2.59 67.73,2.51 58.42,2.51 arc(57.95,2.6) 57.55,2.87 arc(57.29,3.27) 57.19,3.73 57.19,12.24 57.37,12.42 v1(57.66,12.42)
U2_5: length 70.5
  Top Layer w0.254: v1(68.55,17.76) 68.32,17.99 68.32,18.21 66.27,20.27 65.66,20.27 arc(65.52,20.3) 65.41,20.37 65.27,20.37 65.02,20.63 64.72,20.63 64.69,20.65 arc(64.66,20.66) 64.63,20.68 64.35,20.85 arc(64.32,20.87) 64.29,20.9 64.13,21.05 arc(64.06,21.17) 64.03,21.3 64.03,22.07 63.57,22.52 63.57,23.35 63.39,23.53 62.48,23.53 v1(62.27,23.31) ; LED7.2 48.16,22.81 50.06,22.81 51.68,24.44 v1(53.97,24.44) ; v1(65.96,10.82) 63.81,8.67 58.93,8.67 58.67,8.42 58.67,3.26 58.93,3.01 70.1,3.01 70.36,3.26 70.36,4.17 U2.5
  Bottom Layer w0.254: v1(53.97,24.44) 54.35,24.82 54.35,25.2 54.83,25.67 59.53,25.67 60.29,26.43 62.29,26.43 62.42,26.3 62.68,26.3 62.89,26.09 62.89,25.3 63.48,24.71 63.48,24.23 62.69,23.44 62.4,23.44 v1(62.27,23.31) ; v1(68.55,17.76) 68.78,17.53 68.78,17.39 68.83,17.34 68.83,16.63 69.45,16.01 69.45,15.15 68.83,14.53 68.83,12.73 68.84,12.72 68.84,11.54 68.83,11.53 68.83,10.85 68.81,10.82 v1(65.96,10.82)
U2_6: length 50.1
  Top Layer w0.254: v1(68.72,21.58) 68.72,22.02 68.46,22.28 68.46,22.66 68.11,23 68.11,23.25 67.45,23.92 63.77,26.15 arc(63.76,26.15) 63.75,26.16 61.34,27.64 60.05,27.64 59.97,27.72 59.25,27.72 LED8.2 ; v1(71.89,14.23) 72.61,13.51 79.63,13.51 80.64,12.5 80.64,3.35 80.01,2.72 73.1,2.72 72.92,2.9 U2.6
  Bottom Layer w0.254: v1(68.72,21.58) 68.92,21.38 69.12,21.38 69.81,20.69 69.81,19.71 69.21,19.12 69.85,18.48 69.85,17.83 71.3,16.38 71.3,16.32 71.5,16.12 71.5,15.96 71.51,15.95 71.51,15.66 71.89,15.28 v1(71.89,14.23)
U2_7: length 113
  Top Layer w0.254: LED4.2 8.76,16.56 8.94,16.38 10.03,16.38 10.59,15.82 19.21,13.78 19.8,13.78 20.7,12.88 20.7,12.11 21.7,10.35 22.73,9.32 22.73,8.57 23.78,7.52 23.78,7.01 24.13,6.66 24.13,6.4 25.27,5.26 25.27,4.14 26.28,3.13 26.28,2.22 27.81,0.69 29.98,0.69 30.21,0.91 30.58,0.91 30.99,1.32 32.56,1.32 43.43,3.48 45.08,5.13 45.08,5.63 45.15,5.69 45.15,6.67 43.72,8.09 43.72,15.71 48.13,20.12 49.42,20.12 52.5,21.82 53.59,22.91 54.47,22.91 57.3,24.48 arc(57.45,24.54) 57.62,24.52 57.66,24.56 58.29,24.56 59.4,23.45 64.74,20.19 arc(64.74,20.19) 64.74,20.19 65.02,20.02 65.18,20.02 65.43,19.87 66.16,19.87 67.69,18.34 67.69,18.34 67.97,18.06 67.97,17.52 68.2,17.28 68.2,17.02 67.57,16.38 67.57,15.23 68.2,14.6 68.2,13.31 67.42,13.31 66.55,12.43 66.55,6.02 66.73,5.84 73.81,5.84 U2.7
U2_9: length 22.4
  Top Layer w0.254: v1(74.17,11.99) 74.46,11.7 74.46,11.54 75.05,10.95 75.87,10.95 76.91,11.99 77.86,11.99 U2.9 ; v1(70.8,13.51) 70.8,13.76 70.51,14.05 70.08,14.05 69.83,14.3 69.51,14.3 68.28,15.53 68.28,16.01 68.41,16.14 68.41,16.21 69.81,17.62 70.22,17.62 70.34,17.49 70.83,17.49 71.17,17.83 71.17,18.27 71.3,18.39 71.3,18.44 69.93,19.8 69.93,20.24 70.03,20.33 71.04,20.33 LED9.2
  Bottom Layer w0.254: v1(70.8,13.51) 71.92,12.39 71.92,11.54 72.51,10.95 73.33,10.95 73.92,11.54 73.92,11.74 v1(74.17,11.99)
U2_10: length 78
  Top Layer w0.254: v1(74.17,10.85) 73.91,10.59 72.86,10.59 71.92,11.54 71.92,12.72 72.08,12.89 v1(72.08,13.17) ; LED5.2 27.77,39.78 27.77,39.55 28.02,39.3 28.39,38.14 28.39,37.45 28.8,37.03 28.8,36.66 30.27,35.18 30.27,33.42 30.92,32.77 30.92,31.61 30.88,31.57 30.88,31.26 31.09,31.06 31.09,30.84 31.57,30.36 31.57,27.86 31.62,27.81 31.62,27.65 32.88,26.39 34.23,26.39 39.74,20.88 40.38,21.51 v1(41.4,21.51)
  Bottom Layer w0.254: U2.10 75.45,12.13 v1(74.17,10.85) ; v1(72.08,13.17) 72.15,13.23 72.15,13.28 71.78,13.65 71.65,13.65 71.31,13.99 71.31,14.47 71.37,14.54 71.37,14.56 71.16,14.78 71.16,15.8 71.09,15.86 71.09,15.95 70.9,16.14 70.9,16.27 69.49,17.68 69.49,18.33 68.8,19.02 68.14,19.02 67.45,19.71 67.45,20.22 67.16,20.51 67.16,20.83 67.11,20.89 67.11,21.95 67.16,22 67.16,23.03 66.91,23.28 66.91,23.91 67.03,24.03 67.02,24.03 66.62,24.43 63.77,26.15 arc(63.76,26.15) 63.75,26.16 63.02,26.61 62.88,26.61 62.83,26.66 62.59,26.66 62.12,27.13 60.48,27.13 60.14,26.8 60.08,26.8 59.74,26.46 59.74,26.39 59.38,26.03 55.05,26.03 54.73,26.34 54.61,26.34 54.29,26.66 54.02,26.66 53.5,27.19 52.73,27.19 48.31,24.75 48.25,24.69 48.25,24.66 48.16,24.57 48.16,22.13 47.77,21.74 41.63,21.74 v1(41.4,21.51)
U2_11: length 35.3
  Bottom Layer w0.254: LED10.2 81.91,38.74 81.91,28.88 80.01,26.98 80.01,22.91 79.4,22.3 arc(79.4,22.3) 79.4,22.3 79.22,22.2 79.12,22.2 78.99,22.07 72.7,18.55 arc(72.54,18.39) 72.48,18.17 72.48,14.03 arc(72.6,13.73) 72.9,13.61 72.92,13.59 U2.11

## Text on the board
Bottom Silkscreen Layer: Made by Aurel | github.com/aurelzero/DMTBlinky
Top Silkscreen Layer: Aurel was here :3 | N | H | N,N-dimethyltryptamine | - | +
